# Altium schematic sheet Power.SchDoc
size A; SheetNumber: 2; SheetTotal: 7
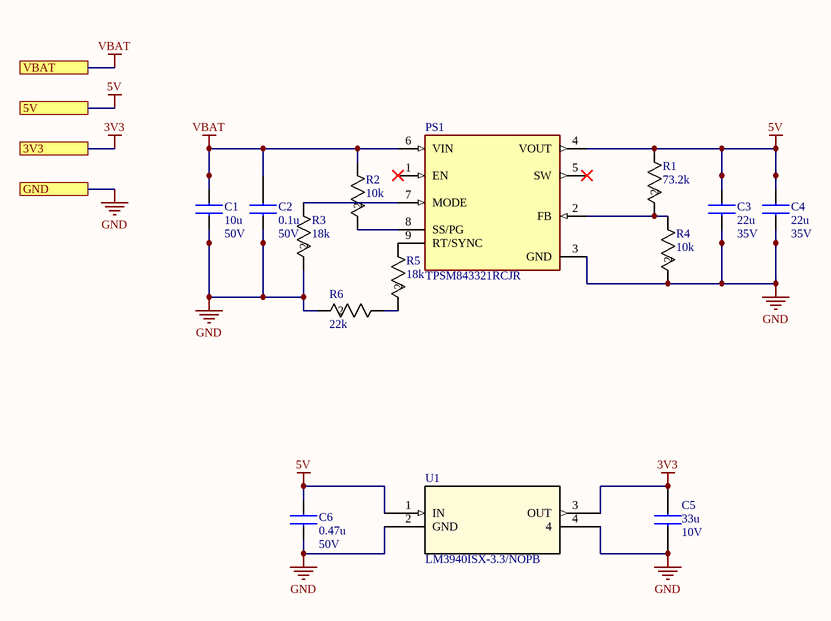
[diagram p0: Power.SchDoc]

## Parts
C1  value 10u  Rated Voltage: 50V  [CAPC2012X145N]  (hidden comment: C2012X5R1H106K125AC)
C2  value 0.1u  Rated Voltage: 50V  [CAPC2012X145N]  (hidden comment: KAM21BR71H104JM)
C3  value 22u  Rated Voltage: 35V  [CAPC2012X145N]  (hidden comment: C2012X5R1V226M125AC)
C4  value 22u  Rated Voltage: 35V  [CAPC2012X145N]  (hidden comment: C2012X5R1V226M125AC)
C5  value 33u  Rated Voltage: 10V  [CAPC2012X145N]  (hidden comment: C2012X5R1A336M125AC)
C6  value 0.47u  Rated Voltage: 50V  [CAPC2012X145N]  (hidden comment: GCM21BR71H474KA55K)
PS1  TPSM843321RCJR  [MODULE_TPSM843321RCJR]
R1  value 73.2k  [RC0805N_YAG]  (hidden comment: RC0805FR-0773K2L)
R2  value 10k  [RC0805N_YAG]  (hidden comment: RC0805FR-0710KL)
R3  value 18k  [RC0805N_YAG]  (hidden comment: RC0805FR-0718KL)
R4  value 10k  [RC0805N_YAG]  (hidden comment: RC0805FR-0710KL)
R5  value 18k  [RC0805N_YAG]  (hidden comment: RC0805FR-0718KL)
R6  value 22k  [RC0805N_YAG]  (hidden comment: RC0805FR-0722KL)
U1  LM3940ISX-3.3/NOPB  [TS3B]

## Ports
3V3, 5V, GND, VBAT

## Nets
3V3: C5.2 U1.3(OUT) ; port 3V3
5V: C3.2 C4.2 C6.2 PS1.4(VOUT) R1.1 U1.1(IN) ; port 5V
GND: C1.1 C2.1 C3.1 C4.1 C5.1 C6.1 PS1.3(GND) R3.2 R4.2 R6.2 U1.2(GND) U1.4 ; port GND
VBAT: C1.2 C2.2 PS1.6(VIN) R2.1 ; port VBAT
NetPS1_2: PS1.2(FB) R1.2 R4.1
NetPS1_7: PS1.7(MODE) R3.1
NetPS1_8: PS1.8(SS/PG) R2.2
NetPS1_9: PS1.9(RT/SYNC) R5.1
NetR5_2: R5.2 R6.1

Not connected (* = marked no-connect by the designer): PS1 1(EN)* 5(SW)*

## Library data of the parts
C1 = C2012X5R1H106K125AC: Multilayer Ceramic Chip Capacitors, Capacitance=10?F, LxWxT:2x1.25x1.25mm; Manufacturer_Name: TDK; Geometry.Height: 1.45mm; Mouser Part Number: 810-C2012X5R1H106K12; Mouser Price/Stock: https://www.mouser.co.uk/ProductDetail/TDK/C2012X5R1H106K125AC?qs=rSMjJ%252B1ewcQGpfDVduhUmg%3D%3D; Manufacturer_Part_Number: C2012X5R1H106K125AC; Datasheet Link: https://product.tdk.com/info/en/catalog/datasheets/mlcc_commercial_midvoltage_en.pdf
C2 = KAM21BR71H104JM: Multilayer Ceramic Chip Capacitors, Capacitance=0.1u; Manufacturer_Part_Number: KAM21BR71H104JM
C3 C4 = C2012X5R1V226M125AC: Multilayer Ceramic Chip Capacitors, Capacitance=22u; Manufacturer_Part_Number: C2012X5R1V226M125AC
C5 = C2012X5R1A336M125AC: Multilayer Ceramic Chip Capacitors, Capacitance=33u; Manufacturer_Part_Number: C2012X5R1A336M125AC
C6 = GCM21BR71H474KA55K: Multilayer Ceramic Chip Capacitors, Capacitance=0.47u; Manufacturer_Part_Number: GCM21BR71H474KA55K
PS1 = TPSM843321RCJR: Non-Isolated PoL Module DC DC Converter 1 Output 5V 3A 3.8V - 18V Input; MF: Texas Instruments; SnapEDA_Link: https://www.snapeda.com/parts/TPSM843321RCJR/Texas+Instruments/view-part/?ref=snap; Package: None; Value: *; MP: TPSM843321RCJR; Check_prices: https://www.snapeda.com/parts/TPSM843321RCJR/Texas+Instruments/view-part/?ref=eda
R1 = RC0805FR-0773K2L: RES 0805 73.2k 1% 1/8W; Manufacturer_Name: Yageo; Manufacturer_Part_Number: RC0805FR-0773K2L; Tolerance: 1%
R2 R4 = RC0805FR-0710KL: RES 0805 10k 1% 1/8W; Manufacturer_Name: Yageo; Manufacturer_Part_Number: RC0805FR-0710KL; Tolerance: 1%
R3 R5 = RC0805FR-0718KL: RES 0805 18k 1% 1/8W; Manufacturer_Name: Yageo; Manufacturer_Part_Number: RC0805FR-0718KL; Tolerance: 1%
R6 = RC0805FR-0722KL: RES 0805 22k 1% 1/8W; Manufacturer_Name: Yageo; Manufacturer_Part_Number: RC0805FR-0722KL; Tolerance: 1%
U1 = LM3940ISX-3.3NOPB: 1-A, low-dropout voltage regulator for 5-V to 3.3-V conversion 3-DDPAK/TO-263 -40 to 125; Manufacturer_Name: Texas Instruments; Type: LM3940IS-3.3; Copyright: Copyright (C) 2025 Ultra Librarian. All rights reserved.; Manufacturer_Part_Number: LM3940ISX-3.3/NOPB; Datasheet: https://www.ti.com/lit/gpn/lm3940; RefDes: RefDes